# EAGLE design TBD-board (EAGLE 8.2.2)
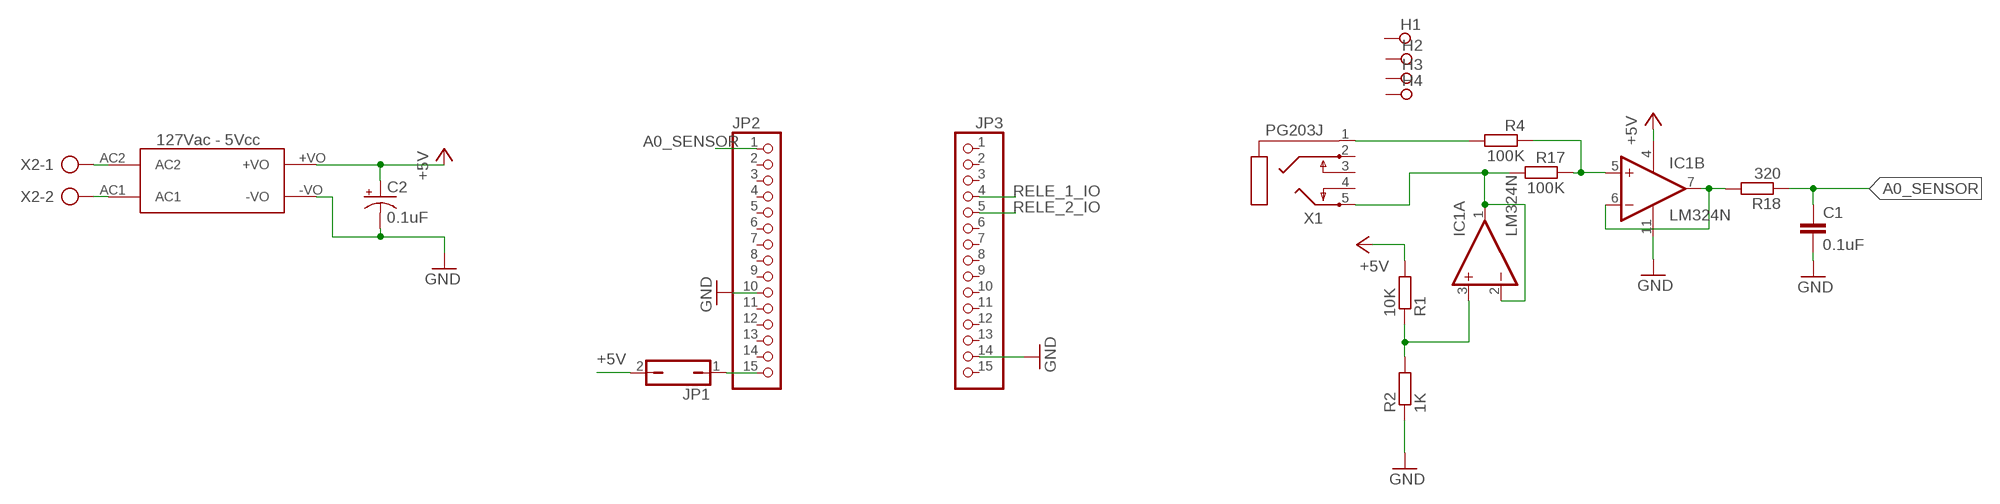
[diagram p0: schematic, sheet 1]

## Parts
C1  0.1uF  C5/5  [C5B5]
C2  0.1uF  CPOL-USE2.5-6  [E2,5-6]
FONTE  HLK-PM01  [HLK-PM01]
H1  SPECIAL_DRILL_0.1000  [PAD_0.1000]
H2  SPECIAL_DRILL_0.1000  [PAD_0.1000]
H3  SPECIAL_DRILL_0.1000  [PAD_0.1000]
H4  SPECIAL_DRILL_0.1000  [PAD_0.1000]
IC1  LM324N  [DIL14]
JP1  JP1Q  [JP1]
JP2  PINHD-1X15  [1X15]
JP3  PINHD-1X15  [1X15]
R1  10K  R-EU_0207/7  [0207/7]
R2  1K  R-EU_0207/7  [0207/7]
R4  100K  R-EU_0207/7  [0207/7]
R17  100K  R-EU_0207/7  [0207/7]
R18  320  R-EU_0207/7  [0207/7]
X1  PG203J  [PG203J]
X2  AK300/2  [AK300/2]

## Nets
+5V: C2.+ FONTE.+VO IC1.4(P:V+) JP1.2 R1.2
A0_SENSOR: C1.1 JP2.1 R18.1
GND: C1.2 C2.- FONTE.-VO IC1.11(P:V-) JP2.10 JP3.14 R2.1
LOAD+: FONTE.AC2 X2.1
LOAD-: FONTE.AC1 X2.2
N$1: IC1.3(A:+IN) R1.1 R2.2
N$2: JP1.1 JP2.15
N$3: R4.2 X1.1
N$32: IC1.5(B:+IN) R4.1 R17.1
N$33: IC1.6(B:-IN) IC1.7(B:OUT) R18.2
RELE_1_IO: JP3.4
RELE_2_IO: JP3.5
SENSOR-A-2: IC1.1(A:OUT) IC1.2(A:-IN) R17.2 X1.5
Unconnected: H1.1 H2.1 H3.1 H4.1 IC1.8(C:OUT) IC1.9(C:-IN) IC1.10(C:+IN) IC1.12(D:+IN) IC1.13(D:-IN) IC1.14(D:OUT) JP2.2 JP2.3 JP2.4 JP2.5 JP2.6 JP2.7 JP2.8 JP2.9 JP2.11 JP2.12 JP2.13 JP2.14 JP3.1 JP3.2 JP3.3 JP3.6 JP3.7 JP3.8 JP3.9 JP3.10 JP3.11 JP3.12 JP3.13 JP3.15 X1.2 X1.3 X1.4

## Library data of the parts
C1 = capacitor-wima:C: CAPACITOR naming: grid - package width
C2 = rcl:CPOL-US: POLARIZED CAPACITOR, American symbol
FONTE = hlk-pm01:HLK-PM01; FONTE: 127Vac - 5Vcc
H1-H4 = special-drill:SPECIAL_DRILL_: Special drills
IC1 = linear:LM324: OP AMP
JP1 = jumper:JP1Q: JUMPER
JP2 JP3 = pinhead:PINHD-1X15: PIN HEADER
R1 R2 R4 R17 R18 = resistor:R-EU_: RESISTOR, European symbol
X1 = con-hirschmann:PG203J: MIC/HEADPHONE JACK KS-S stereo microphone/headphone jack PG203JN (Schukat); OC_FARNELL: unknown; OC_NEWARK: unknown
X2 = con-ptr500:AK300/2: CONNECTOR; OC_FARNELL: unknown; OC_NEWARK: unknown

## Net classes
0 default: width 1.27 mm

## Board
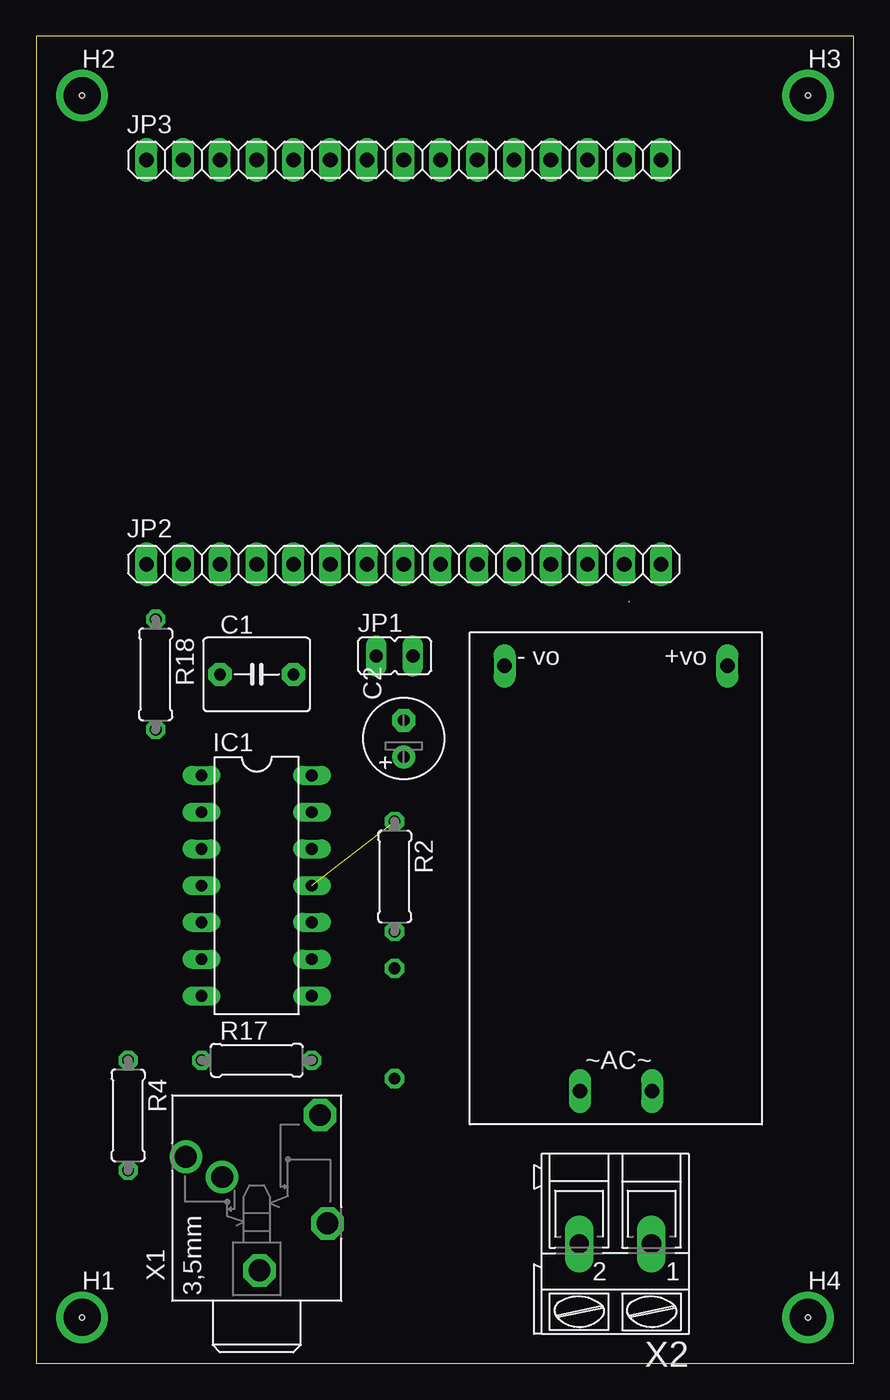
[diagram p1: board, top side]
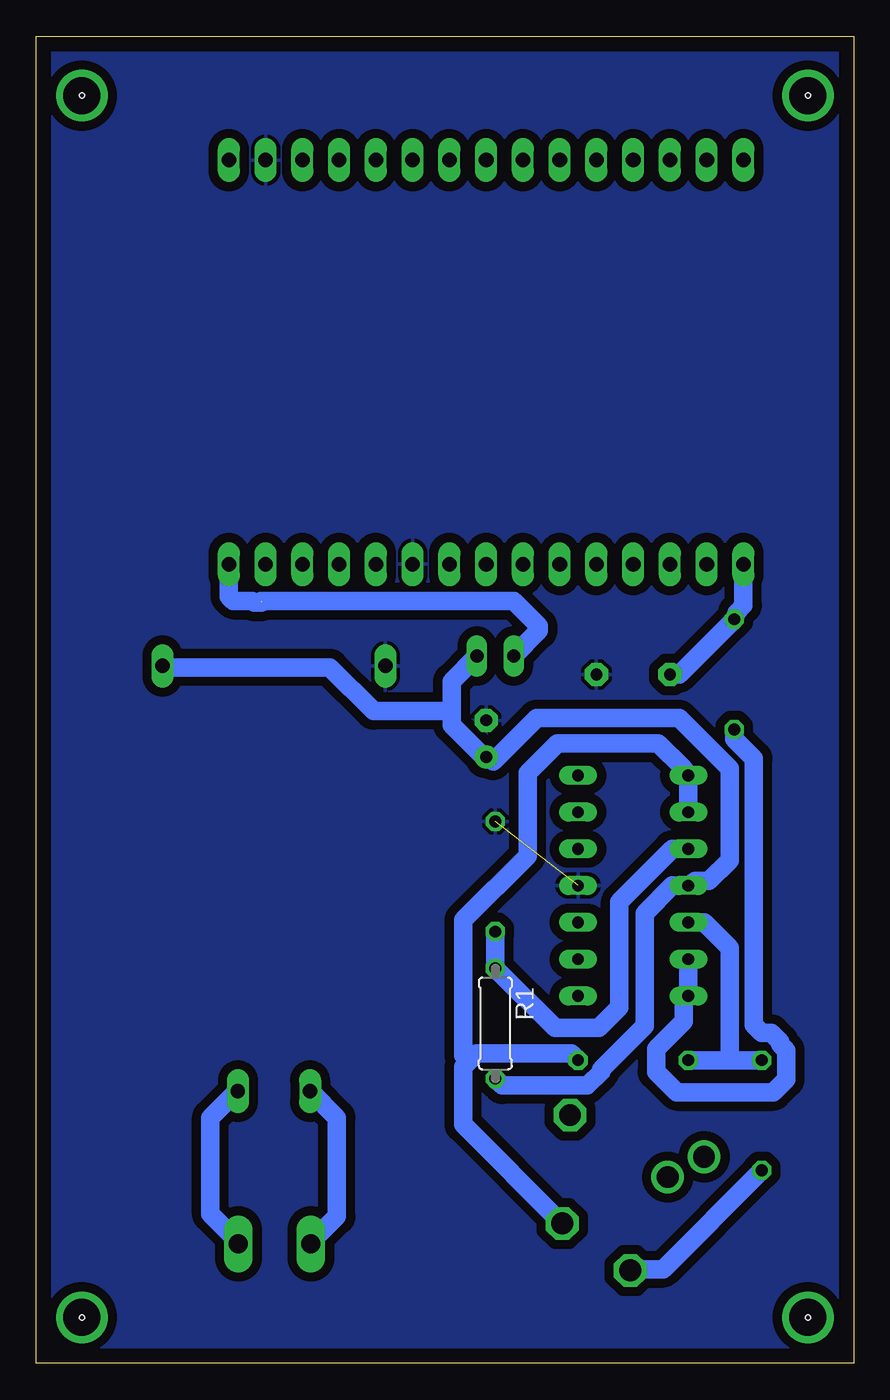
[diagram p2: board, bottom side, seen from below]

Size 56.49 x 91.75 mm. Coordinates in mm from the lower left corner, seen from the top.
Outline: 0,0 56.49,0 56.49,91.75 0,91.75 0,0
Copper layers (1*16): Top 0.035mm / dielectric 1.5mm / Bottom 0.035mm
Design rules "mycofigED *": minimum track width 10mil, minimum drill 24mil, track to track 20mil, track to pad 20mil, pad to pad 20mil, via to via 20mil, smd to smd 10mil, copper to edge 40mil, drill to drill 8mil, minimum pad ring 10mil, minimum via ring 8mil, stop-mask expansion 4mil, vias tented up to drill 0mil, thermal gap 10mil
Holes 0.35 mm at 3.17,3.17 53.34,3.17 53.34,87.63 3.17,87.63

### Footprints (pad centres in the part's own frame; a part is rotated, then mirrored left to right if it is on the bottom)
C5B5 = drill 0.813 pad 1.6 octagon: 1 -2.54,0; 2 2.54,0
E2,5-6 = drill 0.813 pad 1.6: + -1.27,0 | drill 0.813 pad 1.6 octagon: - 1.27,0
HLK-PM01 = drill 1 long: +VO 31.7,2.4; -VO 31.7,17.8; AC1 2.3,12.6; AC2 2.3,7.6
PAD_0.1000 = drill 2.54 pad 2.54: 1 0,0
DIL14 = drill 0.813 long: 1 -7.62,-3.81; 2 -5.08,-3.81; 3 -2.54,-3.81; 4 0,-3.81; 5 2.54,-3.81; 6 5.08,-3.81; 7 7.62,-3.81; 8 7.62,3.81; 9 5.08,3.81; 10 2.54,3.81; 11 0,3.81; 12 -2.54,3.81; 13 -5.08,3.81; 14 -7.62,3.81
JP1 = drill 0.914 long: 1 0,-1.27; 2 0,1.27
1X15 = drill 1.016 long: 1 -17.78,0; 2 -15.24,0; 3 -12.7,0; 4 -10.16,0; 5 -7.62,0; 6 -5.08,0; 7 -2.54,0; 8 0,0; 9 2.54,0; 10 5.08,0; 11 7.62,0; 12 10.16,0; 13 12.7,0; 14 15.24,0; 15 17.78,0
0207/7 = drill 0.813 octagon: 1 -3.81,0; 2 3.81,0
PG203J = drill 1.499 octagon: 1 -5.004,-0.203; 4 5.74,-4.369; 5 -1.753,-4.902 | drill 1.499: 2 2.845,4.902; 3 1.448,2.388
AK300/2 = drill 1.321 long: 1 -2.515,0; 2 2.489,0

### Placement (x,y rotation side)
C1  15.24,47.62 0 top
C2  25.4,43.18 90 top
FONTE  50.16,16.51 90 top
H1  3.17,3.17 0 top
H2  3.17,87.63 0 top
H3  53.34,87.63 0 top
H4  53.34,3.17 0 top
IC1  15.24,33.02 270 top
JP1  24.77,48.9 270 top
JP2  25.4,55.24 0 top
JP3  25.4,83.19 0 top
R1  24.77,23.5 270 bottom
R2  24.77,33.66 270 top
R4  6.35,17.14 270 top
R17  15.24,20.95 0 top
R18  8.26,47.62 270 top
X1  15.24,11.43 90 top
X2  40.01,8.25 180 top

### Tracks (layer width: path | path; a pad name or v marks a point on that pad's centre or on a via)
+5V
  Bottom 1.27: JP1.2 27.78,47.15 27.78,45.09 | 27.78,45.09 27.78,44.13 25.56,41.91 C2.+ 24.92,41.59 21.91,44.61 12.06,44.61 8.57,41.12 8.57,34.77 10,33.34 10.95,33.34 IC1.4 12.54,33.02 14.45,31.12 14.45,23.34 17.46,20.32 17.46,20.16 18.41,19.21 24.29,19.21 R1.2 | 27.78,45.09 33.18,45.09 36.2,48.1 47.62,48.1 FONTE.+VO
A0_SENSOR
  Bottom 1.27: C1.1 12.06,47.62 R18.1 8.1,51.91 7.62,52.39 JP2.1
GND  (1 unrouted)
  pour Bottom (isolate 0.635): 0,90.81 56.52,90.81 56.52,0 0,0
LOAD+
  Bottom 1.27: FONTE.AC2 42.7,18.73 44.45,16.99 44.45,10.32 42.39,8.25 X2.1
LOAD-
  Bottom 1.27: FONTE.AC1 37.47,18.73 35.72,16.99 35.72,10.16 37.62,8.25 X2.2
N$1
  Bottom 1.27: IC1.3 12.54,35.56 16.19,31.91 16.19,24.61 17.62,23.18 20.64,23.18 R1.1 R2.2
N$2  (1 unrouted)
  Bottom 1.27: JP1.1 21.75,50.64 21.75,50.96 23.5,52.7 40.96,52.7 | JP2.15 43.18,53.02 42.86,52.7 41.56,52.7 41.43,52.58 40.96,52.58
N$3
  Bottom 1.27: R4.2 13.18,6.51 15.4,6.51 X1.1
N$32
  Bottom 1.27: R17.1 8.57,20.95 | 8.57,20.95 R4.1 | IC1.5 10.32,30.48 8.57,28.73 8.57,20.95
N$33
  Bottom 1.27: IC1.6 IC1.7 11.75,24.92 11.75,23.65 13.65,21.75 13.65,20.16 12.22,18.73 5.56,18.73 4.67,19.61 4.67,21.65 5.08,22.06 5.08,22.23 5.71,22.86 6.35,22.86 6.9,23.41 6.9,41.81 8.26,43.17 R18.2
SENSOR-A-2
  Bottom 1.27: IC1.2 IC1.1 11.75,41.12 13.49,42.86 20.48,42.86 22.54,40.8 22.54,35.08 26.99,30.64 26.99,21.27 26.59,20.88 | R17.2 19.53,21.43 26.04,21.43 26.59,20.88 | 26.59,20.88 26.99,20.48 26.99,16.51 20.16,9.68 X1.5